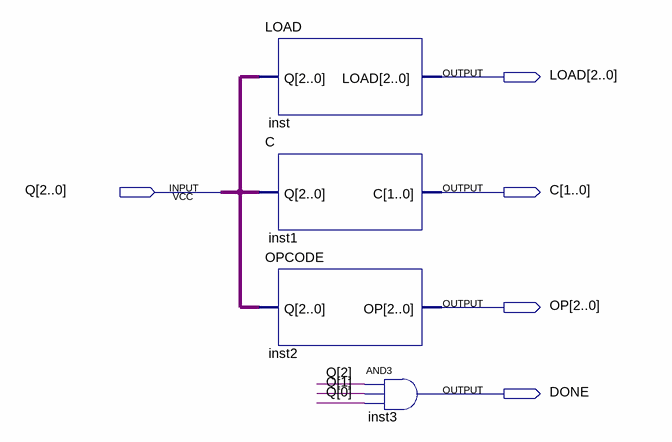
[diagram p0: schematic sheet]
// Quartus schematic OUTPUTLOGIC.bdf as structural Verilog: 4 symbols, 5 pins
module OUTPUTLOGIC (
  input  [2:0] Q,
  output [2:0] LOAD,
  output [1:0] C,
  output [2:0] OP,
  output DONE
);

  LOAD inst (.Q(Q), .LOAD(LOAD));
  C inst1 (.Q(Q), .C(C));
  OPCODE inst2 (.Q(Q), .OP(OP));
  and inst3 (DONE, Q[2], Q[1], Q[0]);
endmodule
